# Altium schematic sheet AD9851_2.SchDoc
size A4
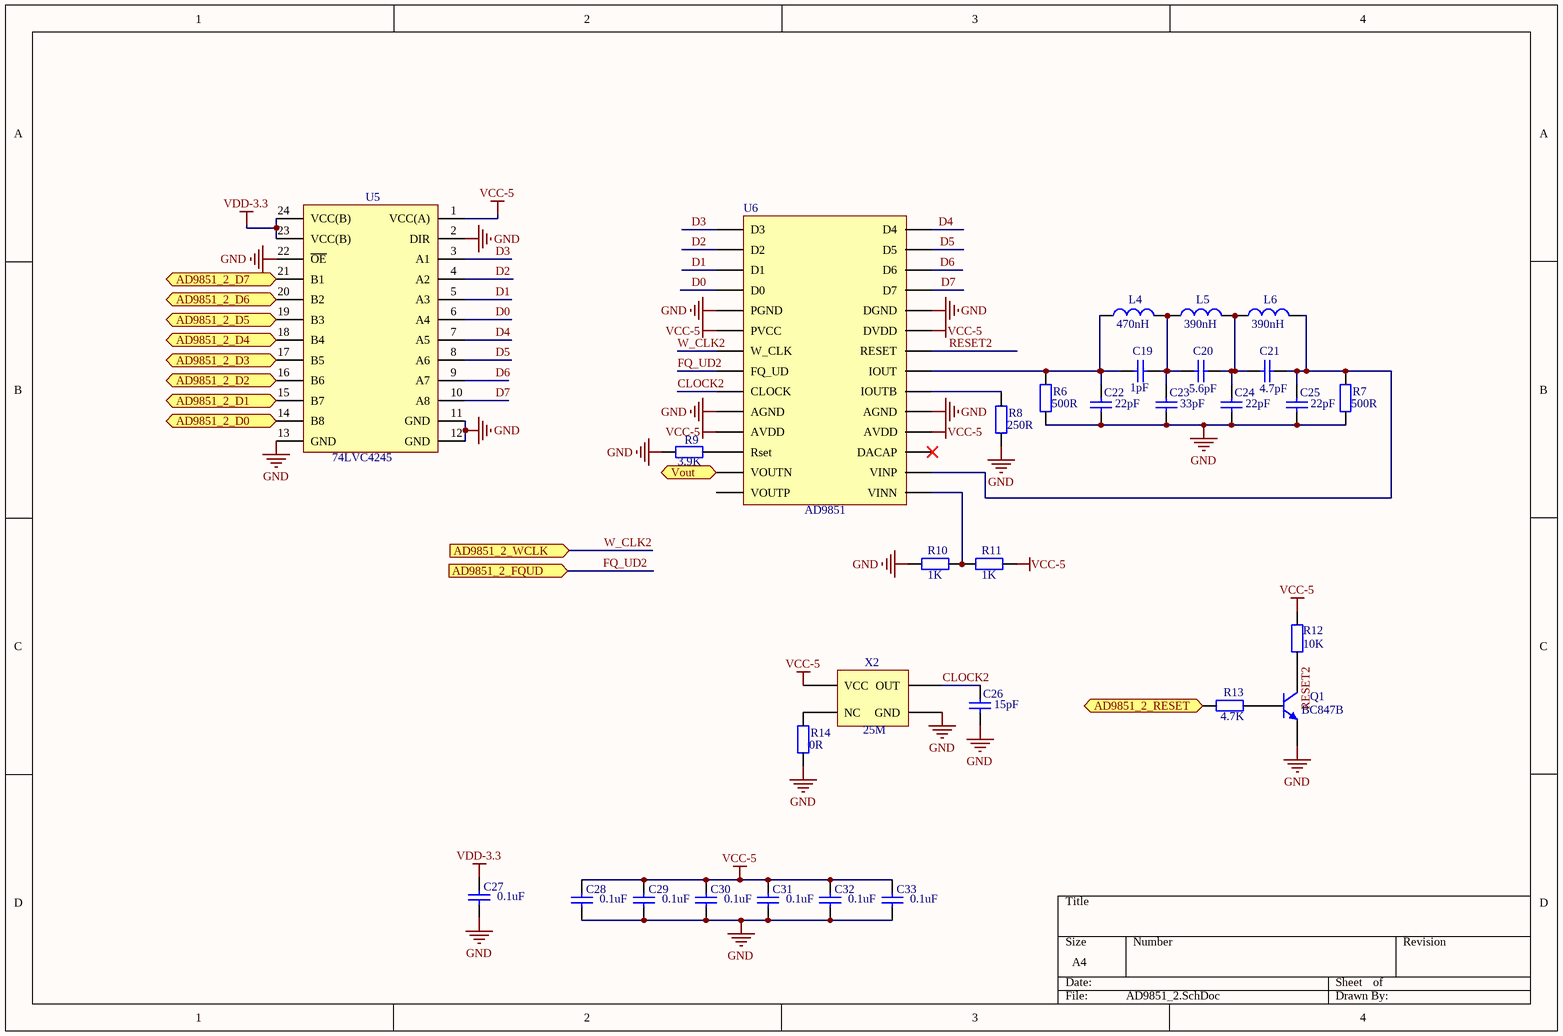
[diagram p0: AD9851_2.SchDoc]

## Parts
C19  value 1pF  [0603]  (hidden comment: Capacitor-0603)
C20  value 5.6pF  [0603]  (hidden comment: Capacitor-0603)
C21  value 4.7pF  [0603]  (hidden comment: Capacitor-0603)
C22  value 22pF  [0603]  (hidden comment: Capacitor-0603)
C23  value 33pF  [0603]  (hidden comment: Capacitor-0603)
C24  value 22pF  [0603]  (hidden comment: Capacitor-0603)
C25  value 22pF  [0603]  (hidden comment: Capacitor-0603)
C26  value 15pF  [0603]  (hidden comment: Capacitor-0603)
C27  value 0.1uF  [0603]  (hidden comment: Capacitor-0603)
C28  value 0.1uF  [0603]  (hidden comment: Capacitor-0603)
C29  value 0.1uF  [0603]  (hidden comment: Capacitor-0603)
C30  value 0.1uF  [0603]  (hidden comment: Capacitor-0603)
C31  value 0.1uF  [0603]  (hidden comment: Capacitor-0603)
C32  value 0.1uF  [0603]  (hidden comment: Capacitor-0603)
C33  value 0.1uF  [0603]  (hidden comment: Capacitor-0603)
L4  value 470nH  [0805]  (hidden comment: Inductor)
L5  value 390nH  [0805]  (hidden comment: Inductor)
L6  value 390nH  [0805]  (hidden comment: Inductor)
Q1  BC847  [BC847B]  (value not drawn)
R6  value 500R  [0603]  (hidden comment: Resistor-0603)
R7  value 500R  [0603]  (hidden comment: Resistor-0603)
R8  value 250R  [0603]  (hidden comment: Resistor-0603)
R9  value 3.9K  [0603]  (hidden comment: Resistor-0603)
R10  value 1K  [0603]  (hidden comment: Resistor-0603)
R11  value 1K  [0603]  (hidden comment: Resistor-0603)
R12  value 10K  [0603]  (hidden comment: Resistor-0603)
R13  value 4.7K  [0603]  (hidden comment: Resistor-0603)
R14  value 0R  [0603]  (hidden comment: Resistor-0603)
U5  74LVC4245  [74LVC4245-PW]
U6  AD9851  [AD9851]
X2  value 25M  [有源晶振7050]  (hidden comment: 有源晶振)

## Ports
AD9851_2_D0 (in), AD9851_2_D1 (in), AD9851_2_D2 (in), AD9851_2_D3 (in), AD9851_2_D4 (in), AD9851_2_D5 (in), AD9851_2_D6 (in), AD9851_2_D7 (in), AD9851_2_FQUD (in), AD9851_2_RESET (in), AD9851_2_WCLK (in), Vout (out)

## Nets
GND: C22.1 C23.1 C24.1 C25.1 C26.1 C27.2 C28.2 C29.2 C30.2 C31.2 C32.2 C33.2 Q1.1(E) R6.1 R7.1 R8.1 R9.2 R10.2 R14.1 U5.2(DIR) U5.11(GND) U5.12(GND) U5.13(GND) U5.22(~{OE}) U6.5(PGND) U6.10(AGND) U6.19(AGND) U6.24(DGND) X2.2(GND)
VCC-5: C28.1 C29.1 C30.1 C31.1 C32.1 C33.1 R11.1 R12.2 U5.1(VCC(A)) U6.6(PVCC) U6.11(AVDD) U6.18(AVDD) U6.23(DVDD) X2.4(VCC)
VDD-3.3: C27.1 U5.23(VCC(B)) U5.24(VCC(B))
AD9851_2_D0: U5.14(B8) ; port AD9851_2_D0
AD9851_2_D1: U5.15(B7) ; port AD9851_2_D1
AD9851_2_D2: U5.16(B6) ; port AD9851_2_D2
AD9851_2_D3: U5.17(B5) ; port AD9851_2_D3
AD9851_2_D4: U5.18(B4) ; port AD9851_2_D4
AD9851_2_D5: U5.19(B3) ; port AD9851_2_D5
AD9851_2_D6: U5.20(B2) ; port AD9851_2_D6
AD9851_2_D7: U5.21(B1) ; port AD9851_2_D7
AD9851_2_RESET: R13.2 ; port AD9851_2_RESET
CLOCK2: C26.2 U6.9(CLOCK) X2.3(OUT)
D0: U5.6(A4) U6.4(D0)
D1: U5.5(A3) U6.3(D1)
D2: U5.4(A2) U6.2(D2)
D3: U5.3(A1) U6.1(D3)
D4: U5.7(A5) U6.28(D4)
D5: U5.8(A6) U6.27(D5)
D6: U5.9(A7) U6.26(D6)
D7: U5.10(A8) U6.25(D7)
FQ_UD2: U6.8(FQ_UD) ; port AD9851_2_FQUD
RESET2: Q1.3(C) R12.1 U6.22(RESET)
Vout: U6.13(VOUTN) ; port Vout
W_CLK2: U6.7(W_CLK) ; port AD9851_2_WCLK
NetC19_1: C19.1 C20.2 C23.2 L4.2 L5.1
NetC19_2: C19.2 C22.2 L4.1 R6.2 U6.21(IOUT)
NetC20_1: C20.1 C21.2 C24.2 L5.2 L6.1
NetC21_1: C21.1 C25.2 L6.2 R7.2 U6.16(VINP)
NetQ1_2: Q1.2(B) R13.1
NetR8_2: R8.2 U6.20(IOUTB)
NetR9_1: R9.1 U6.12(Rset)
NetR10_1: R10.1 R11.2 U6.15(VINN)
NetR14_2: R14.2 X2.1(NC)

Not connected (* = marked no-connect by the designer): U6 14(VOUTP) 17(DACAP)*

## Library data of the parts
Q1 = BC847: Name: BC847B
U5 = 74LVC4245: Name: 74LVC4245
U6 = AD9851: Name: AD9851